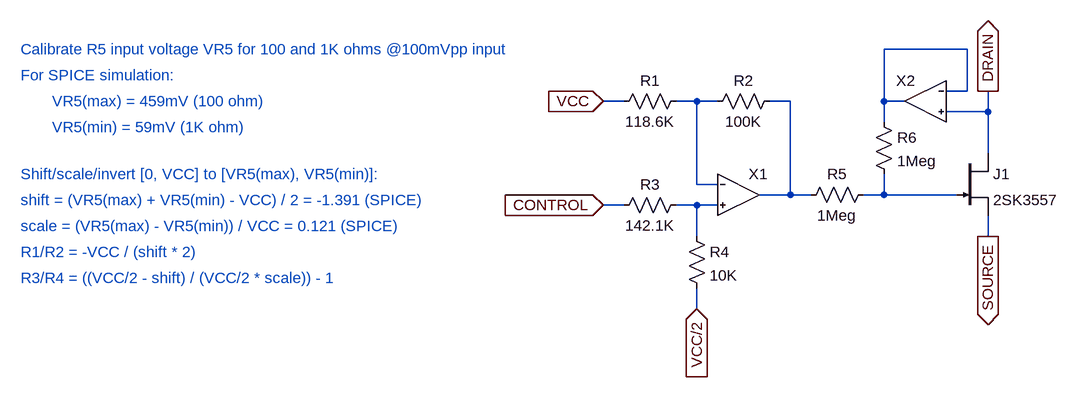
[diagram p0: schematic jfet_1k_100.asc]
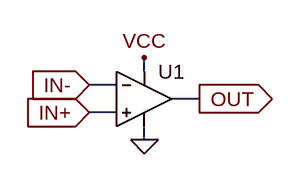
[diagram p1: sub-circuit opamp.asc]
jfet_1k_100.asc, the LTspice schematic file:
Version 4
SHEET 1 1080 680
WIRE 352 -256 224 -256
WIRE 352 -192 352 -256
WIRE 352 -192 320 -192
WIRE -176 -176 -208 -176
WIRE -64 -176 -96 -176
WIRE -32 -176 -64 -176
WIRE 80 -176 48 -176
WIRE 224 -176 224 -256
WIRE 256 -176 224 -176
WIRE 384 -160 384 -192
WIRE 384 -160 320 -160
WIRE 224 -144 224 -176
WIRE 384 -96 384 -160
WIRE -64 -48 -64 -176
WIRE -32 -48 -64 -48
WIRE 80 -32 80 -176
WIRE 80 -32 32 -32
WIRE 112 -32 80 -32
WIRE 224 -32 224 -64
WIRE 224 -32 192 -32
WIRE 336 -32 224 -32
WIRE -176 -16 -208 -16
WIRE -64 -16 -96 -16
WIRE -32 -16 -64 -16
WIRE -64 32 -64 -16
WIRE 384 32 384 0
WIRE -64 144 -64 112
FLAG -208 -16 CONTROL
IOPIN -208 -16 In
FLAG 384 32 SOURCE
IOPIN 384 32 Out
FLAG 384 -192 DRAIN
IOPIN 384 -192 Out
FLAG -208 -176 VCC
IOPIN -208 -176 In
FLAG -64 144 VCC/2
IOPIN -64 144 In
SYMBOL res -80 -192 R90
WINDOW 0 0 56 VBottom 2
WINDOW 3 32 56 VTop 2
SYMATTR InstName R1
SYMATTR Value 118.6K
SYMBOL res 64 -192 R90
WINDOW 0 0 56 VBottom 2
WINDOW 3 32 56 VTop 2
SYMATTR InstName R2
SYMATTR Value 100K
SYMBOL res -80 -32 R90
WINDOW 0 0 56 VBottom 2
WINDOW 3 32 56 VTop 2
SYMATTR InstName R3
SYMATTR Value 142.1K
SYMBOL res -80 16 R0
SYMATTR InstName R4
SYMATTR Value 10K
SYMBOL res 208 -48 R90
WINDOW 0 0 56 VBottom 2
WINDOW 3 32 56 VTop 2
SYMATTR InstName R5
SYMATTR Value 1Meg
SYMBOL njf 336 -96 R0
SYMATTR InstName J1
SYMATTR Value 2SK3557
SYMBOL res 208 -160 R0
SYMATTR InstName R6
SYMATTR Value 1Meg
SYMBOL opamp 0 -32 R0
SYMATTR InstName X1
SYMBOL opamp 288 -176 M0
SYMATTR InstName X2
TEXT -1104 -256 Left 2 ;Calibrate R5 input voltage VR5 for 100 and 1K ohms @100mVpp input
TEXT -1104 -216 Left 2 ;For SPICE simulation:
TEXT -1104 -24 Left 2 ;shift = (VR5(max) + VR5(min) - VCC) / 2 = -1.391 (SPICE)
TEXT -1104 -64 Left 2 ;Shift/scale/invert [0, VCC] to [VR5(max), VR5(min)]:
TEXT -1104 16 Left 2 ;scale = (VR5(max) - VR5(min)) / VCC = 0.121 (SPICE)
TEXT -1104 56 Left 2 ;R1/R2 = -VCC / (shift * 2)
TEXT -1104 96 Left 2 ;R3/R4 = ((VCC/2 - shift) / (VCC/2 * scale)) - 1
TEXT -1056 -176 Left 2 ;VR5(max) = 459mV (100 ohm)
TEXT -1056 -136 Left 2 ;VR5(min) = 59mV (1K ohm)

opamp.asc, the sub-circuit schematic file:
Version 4
SHEET 1 880 680
WIRE 144 144 144 128
WIRE 112 160 80 160
WIRE 208 176 176 176
WIRE 112 192 80 192
WIRE 144 224 144 208
FLAG 144 224 0
FLAG 144 128 VCC
FLAG 208 176 OUT
IOPIN 208 176 Out
FLAG 80 192 IN+
IOPIN 80 192 In
FLAG 80 160 IN-
IOPIN 80 160 In
SYMBOL Opamps\\UniversalOpamp2 144 176 R0
SYMATTR InstName U1
SYMATTR Value2 Avol=1Meg GBW=1.2Meg Slew=10Meg

The netlist it stands for:
* jfet_1k_100.asc
R1 N002 VCC 118.6K
R2 N003 N002 100K
R3 N005 CONTROL 142.1K
R4 N005 VCC/2 10K
R5 N004 N003 1Meg
J1 DRAIN N004 SOURCE 2SK3557
R6 N001 N004 1Meg
XX1 N005 N002 N003 opamp
XX2 DRAIN N001 N001 opamp

* block symbol definitions
.subckt opamp IN+ IN- OUT
XU1 IN+ IN- VCC 0 OUT level.2 Avol=1Meg GBW=1.2Meg Slew=10Meg ilimit=25m rail=0 Vos=0 phimargin=45 en=0 enk=0 in=0 ink=0 Rin=500Meg  ; pins IN+ IN- V+ V- OUT
.ends opamp

.model NJF NJF
.model PJF PJF
.lib standard.jft
* Calibrate R5 input voltage VR5 for 100 and 1K ohms @100mVpp input
* For SPICE simulation:
* shift = (VR5(max) + VR5(min) - VCC) / 2 = -1.391 (SPICE)
* Shift/scale/invert [0, VCC] to [VR5(max), VR5(min)]:
* scale = (VR5(max) - VR5(min)) / VCC = 0.121 (SPICE)
* R1/R2 = -VCC / (shift * 2)
* R3/R4 = ((VCC/2 - shift) / (VCC/2 * scale)) - 1
* VR5(max) = 459mV (100 ohm)
* VR5(min) = 59mV (1K ohm)
.lib UniversalOpamps2.sub
.backanno
.end